# Altium schematic sheet Power.SchDoc
size A4
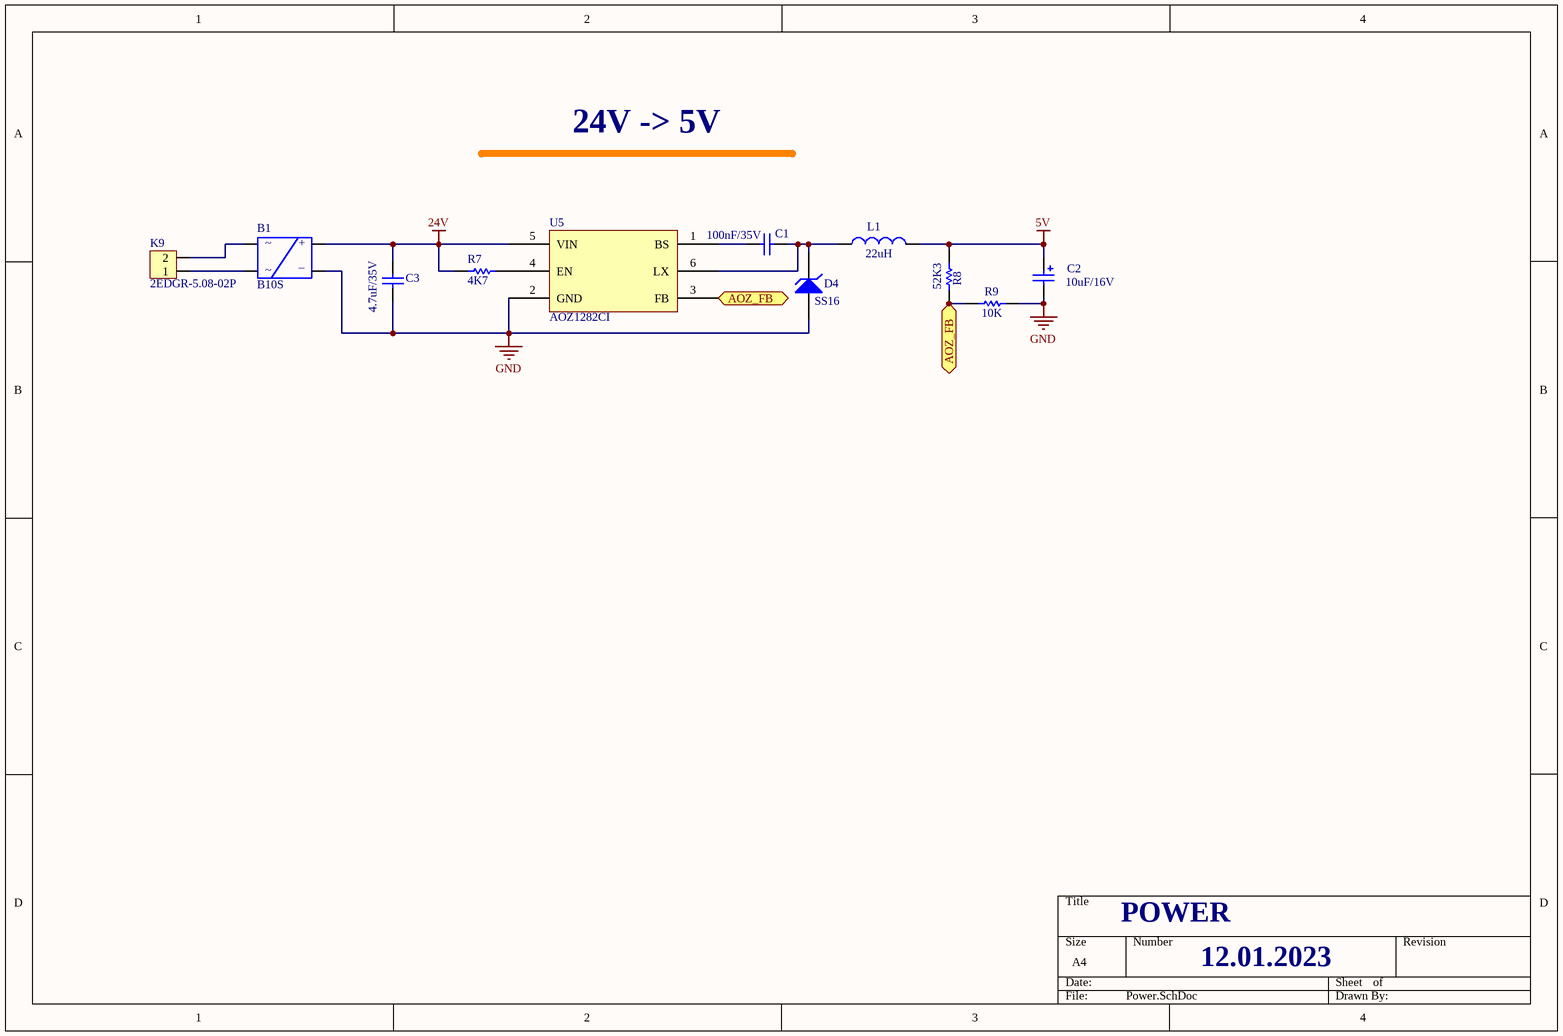
[diagram p0: Power.SchDoc]

## Parts
B1  B10S  [B10S]
C1  100nF/35V  [CAP0603W]
C2  10uF/16V  [CAP A]
C3  4.7uF/35V  [CAP1206W]
D4  SS16  [DO214AC]
K9  2EDGR-5.08-02P  [CON_DG129_02P]
L1  22uH  [INDUCTOR C43]
R7  4K7  [RES1608[0603]]
R8  52K3  [RES1608[0603]]
R9  10K  [RES1608[0603]]
U5  AOZ1282CI  [SOT23-6]

## Ports
AOZ_FB

## Nets
5V: C2.1 L1.2 R8.1
24V: B1.3 C3.1 R7.2 U5.5(VIN)
GND: B1.4 C2.2 C3.2 D4.1(A) R9.1 U5.2(GND)
AOZ_FB: R8.2 R9.2 U5.3(FB) ; port AOZ_FB
NetB1_1: B1.1 K9.2
NetB1_2: B1.2 K9.1
NetC1_1: C1.1 U5.1(BS)
NetC1_2: C1.2 D4.2(K) L1.1 U5.6(LX)
NetR7_1: R7.1 U5.4(EN)

## Notes on the sheet
- 24V -> 5V
- POWER
- 12.01.2023
- (in symbol BRIDGE RECTIFIER) ~; +; _

## Library data of the parts
B1 = BRIDGE RECTIFIER: DIODE B10S MIC SMD; RB156: RB156
C1 = CAP1: CAPACITOR 0603 Case; Value: 100nF; Published: 8-Jun-2000; LatestRevisionDate: 17-Jul-2002; LatestRevisionNote: Re-released for DXP Platform.; PackageReference: C1206; Publisher: Altium Limited
C2 = CAP2: CAPACITOR Polarized Capacitor; Value: 100uF; Published: 8-Jun-2000; LatestRevisionDate: 17-Jul-2002; LatestRevisionNote: Re-released for DXP Platform.; PackageReference: RB7.6-15; Publisher: Altium Limited
C3 = CAP1: CAPACITOR 1206Case; Value: 100nF; Published: 8-Jun-2000; LatestRevisionDate: 17-Jul-2002; LatestRevisionNote: Re-released for DXP Platform.; PackageReference: C1206; Publisher: Altium Limited
D4 = DIODE: DIODE SCHOTTKY SS16 1A 60V DO214AC SMA; Published: 8-Jun-2000; LatestRevisionDate: 17-Jul-2002; LatestRevisionNote: Re-released for DXP Platform.; PackageReference: DIODE-0.7; Publisher: Altium Limited
K9 = KLEMENS_2P: CONNECTOR 5.08mm 2PIN 90DEG
L1 = INDUCTOR: INDUCTOR 22uH SDR43-220M-LF SMD 4.5X4X3.2MM; Code_IEC: 1005; Published: 8-Jun-2000; LatestRevisionDate: 17-Jul-2002; LatestRevisionNote: Re-released for DXP Platform.; PackageReference: 0402-A; Publisher: Altium Limited; Code_JEITA: 0402
R7-R9 = RES: RESISTOR 0603 Case %1; Value: 430R; Published: 8-Jun-2000; LatestRevisionDate: 17-Jul-2002; LatestRevisionNote: Re-released for DXP Platform.; PackageReference: AXIAL-0.5; Publisher: Altium Limited
U5 = AOZ1282CI: REGULATOR IC-1282 REG BUCK ADJ 1.2A SOT23-6